# Altium schematic sheet CircuitControlDriver.SchDoc
size 420 x 297 mm; Address1: Address1; Address2: Address2; Address3: Address3; Address4: Address4; SheetNumber: 1; Scale: 1:1; Разраб.: Лепотенко А.С.; Обозначение документа: СЭЧП.425667.001 Э3; Наименование организации: Systems Electronic; Перв. применение: СЭЧП.425667.001 Э3; Наименование изделия 1: Блок управления ШДР; Наименование изделия 2: Схема электрическая; Наименование изделия 3: принципиальная; Нач. отд.: Нач. отд.
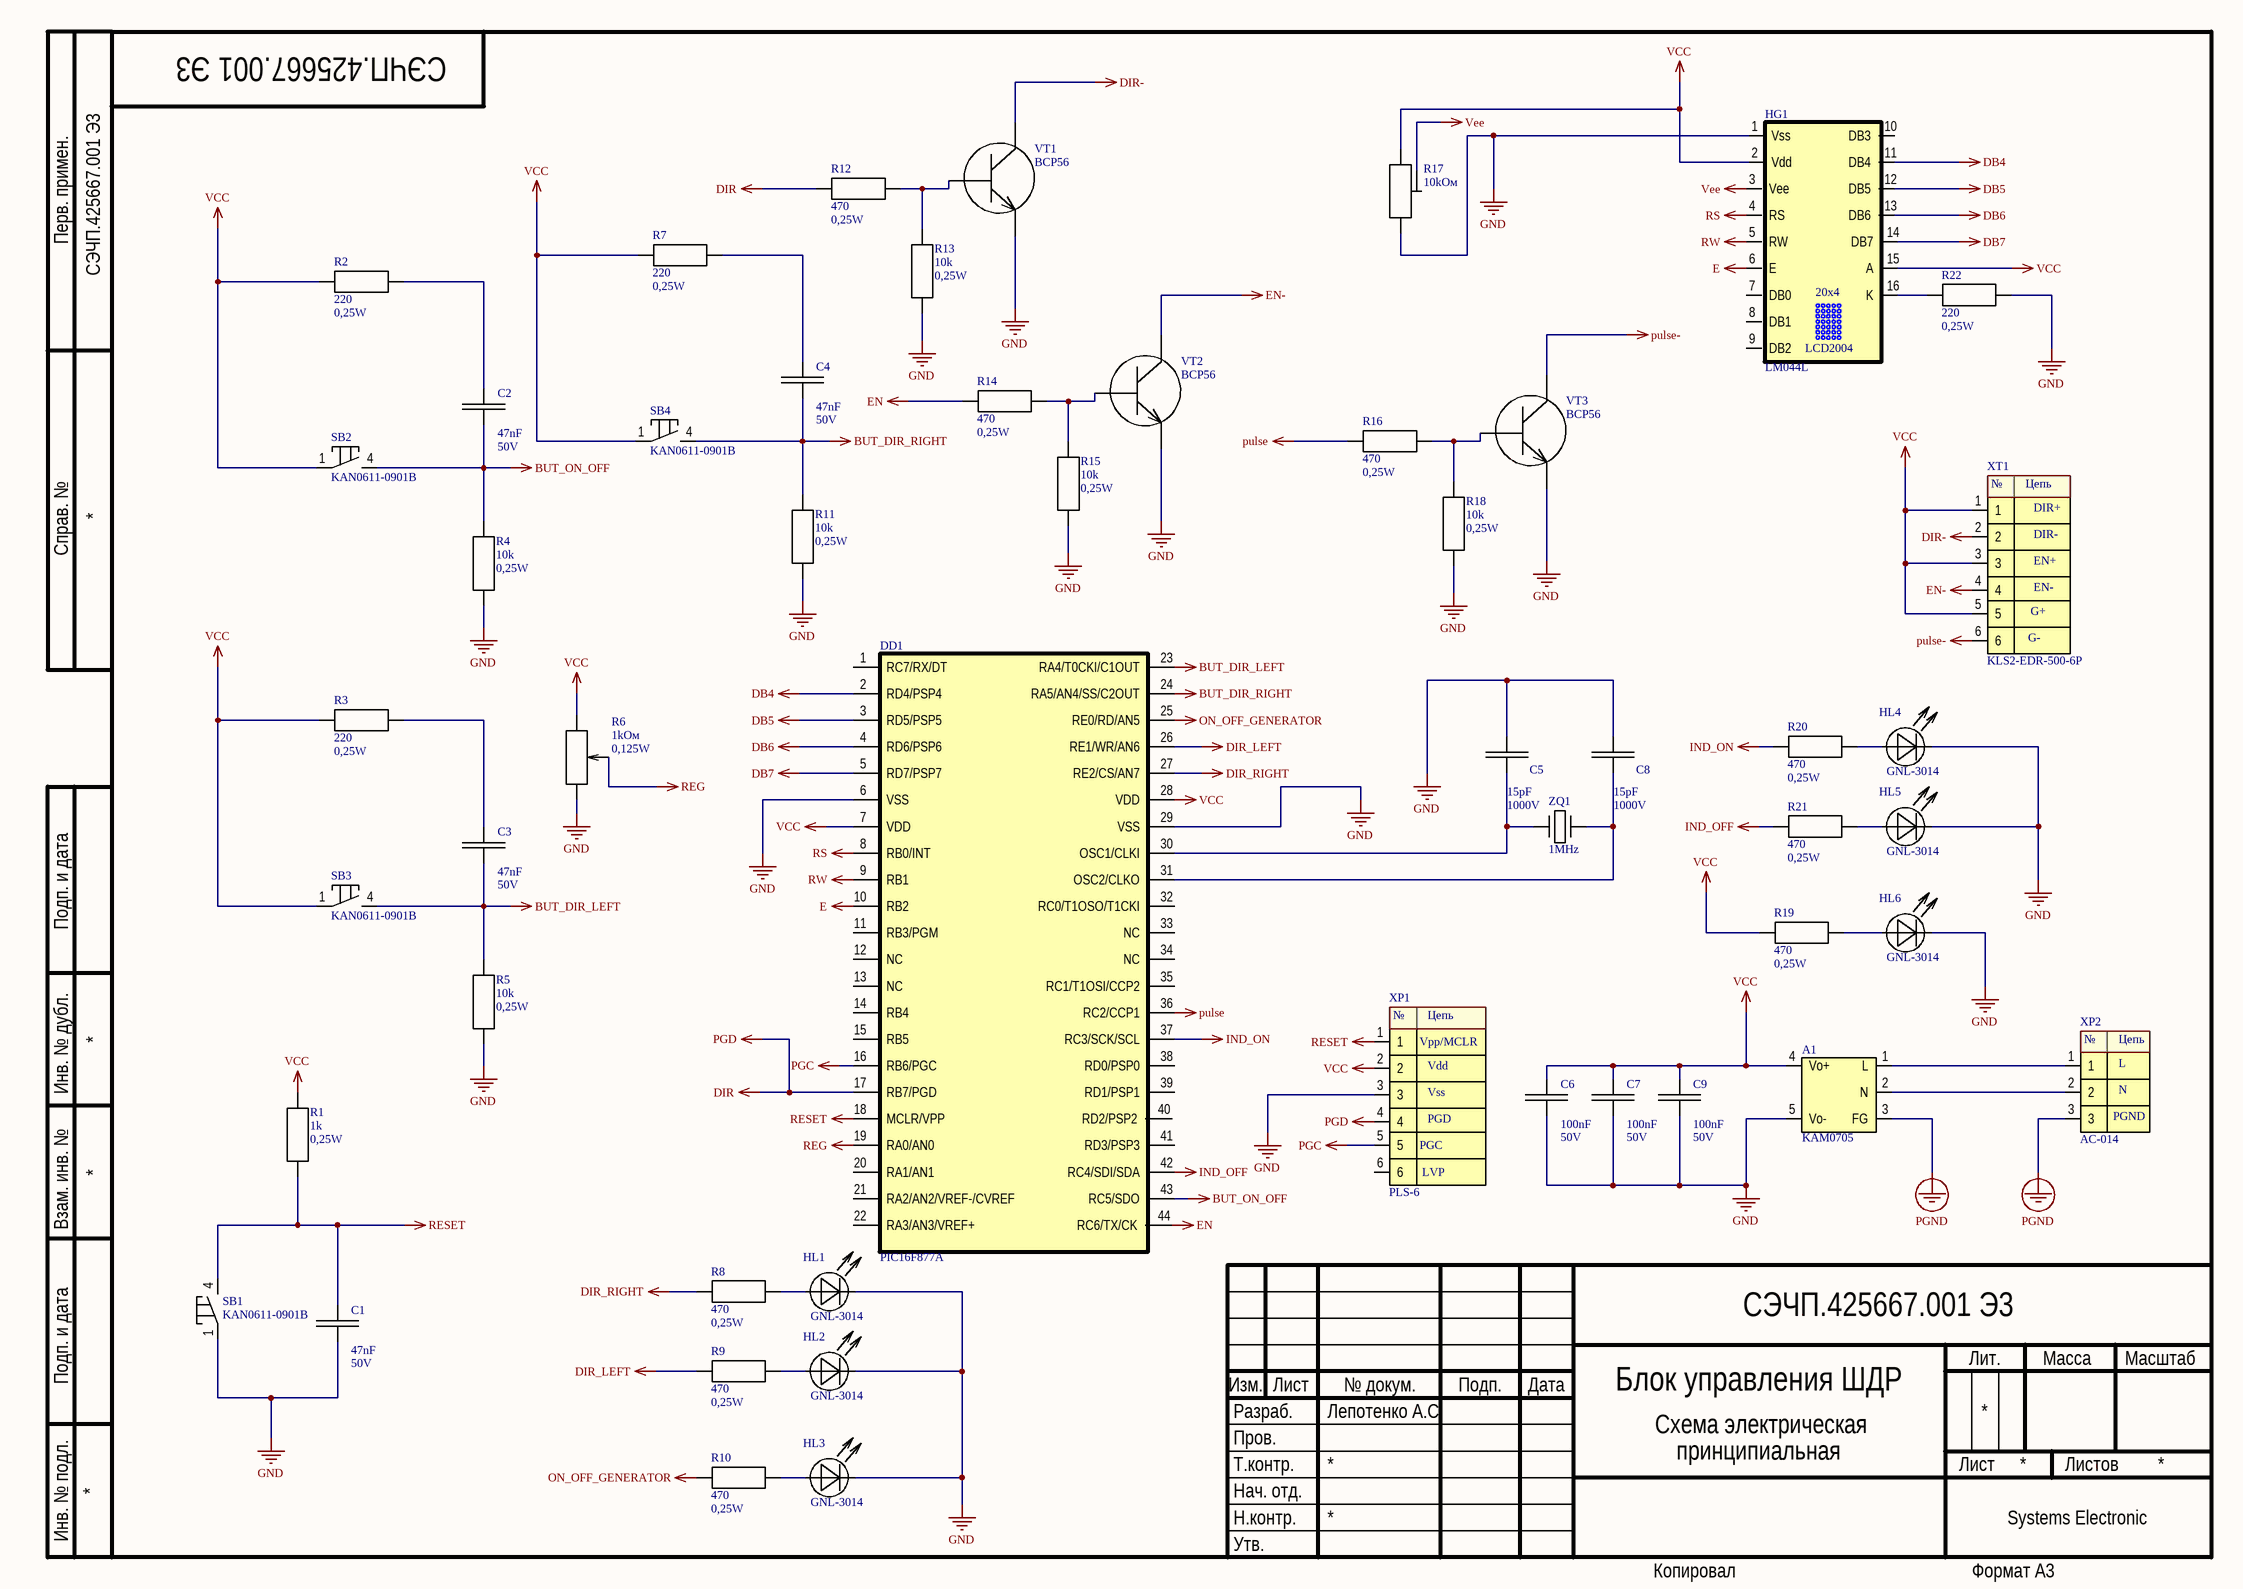
[diagram p0: CircuitControlDriver.SchDoc]

## Parts
A1  KAM0705  [KAM705]
C1  Voltage: 50V  [CAP1206]  (hidden comment: 47nF)
C2  Voltage: 50V  [CAP1206]  (hidden comment: 47nF)
C3  Voltage: 50V  [CAP1206]  (hidden comment: 47nF)
C4  Voltage: 50V  [CAP1206]  (hidden comment: 47nF)
C5  Voltage: 1000V  [CAP1206]  (hidden comment: 15pF)
C6  Voltage: 50V  [CAP1206]  (hidden comment: 100nF)
C7  Voltage: 50V  [CAP1206]  (hidden comment: 100nF)
C8  Voltage: 1000V  [CAP1206]  (hidden comment: 15pF)
C9  Voltage: 50V  [CAP1206]  (hidden comment: 100nF)
DD1  PIC16F877A  [TQFP80P1200X1200X120-44N]
HG1  LM044L  [LCD2004]
HL1  GNL-3014  [GNL-3014]
HL2  GNL-3014  [GNL-3014]
HL3  GNL-3014  [GNL-3014]
HL4  GNL-3014  [GNL-3014]
HL5  GNL-3014  [GNL-3014]
HL6  GNL-3014  [GNL-3014]
R1  value 1k  Power: 0,25W  [1206]  (hidden comment: 10k)
R2  Power: 0,25W  [1206]  (hidden comment: 220)
R3  Power: 0,25W  [1206]  (hidden comment: 220)
R4  Power: 0,25W  [1206]  (hidden comment: 10k)
R5  Power: 0,25W  [1206]  (hidden comment: 10k)
R6  1kОм  Power: 0,125W  [KC/C 16K1]
R7  Power: 0,25W  [1206]  (hidden comment: 220)
R8  Power: 0,25W  [1206]  (hidden comment: 470)
R9  Power: 0,25W  [1206]  (hidden comment: 470)
R10  Power: 0,25W  [1206]  (hidden comment: 470)
R11  Power: 0,25W  [1206]  (hidden comment: 10k)
R12  Power: 0,25W  [1206]  (hidden comment: 470)
R13  Power: 0,25W  [1206]  (hidden comment: 10k)
R14  Power: 0,25W  [1206]  (hidden comment: 470)
R15  Power: 0,25W  [1206]  (hidden comment: 10k)
R16  Power: 0,25W  [1206]  (hidden comment: 470)
R17  10kОм  [3006P]
R18  Power: 0,25W  [1206]  (hidden comment: 10k)
R19  Power: 0,25W  [1206]  (hidden comment: 470)
R20  Power: 0,25W  [1206]  (hidden comment: 470)
R21  Power: 0,25W  [1206]  (hidden comment: 470)
R22  Power: 0,25W  [1206]  (hidden comment: 220)
SB1  KAN0611-0901B  [KLS2]
SB2  KAN0611-0901B  [KLS2]
SB3  KAN0611-0901B  [KLS2]
SB4  KAN0611-0901B  [KLS2]
VT1  BCP56  [SOT223]
VT2  BCP56  [SOT223]
VT3  BCP56  [SOT223]
XP1  PLS-6  [DS1021-6]
XP2  AC-014  [Power AC-014]
XT1  KLS2-EDR-500-6P  [KLS2-EDR-500-6P]
ZQ1  1MHz  [HC-51U]

## Nets
BUT_DIR_LEFT: C3.2 DD1.23(RA4/T0CKI/C1OUT) R5.1 SB3.4
BUT_DIR_RIGHT: C4.2 DD1.24(RA5/AN4/SS/C2OUT) R11.1 SB4.4
BUT_ON_OFF: C2.2 DD1.43(RC5/SDO) R4.1 SB2.4
DB4: DD1.2(RD4/PSP4) HG1.11(DB4)
DB5: DD1.3(RD5/PSP5) HG1.12(DB5)
DB6: DD1.4(RD6/PSP6) HG1.13(DB6)
DB7: DD1.5(RD7/PSP7) HG1.14(DB7)
DIR: DD1.17(RB7/PGD) R12.1 XP1.4  [also labelled PGD]
DIR-: VT1.2 XT1.2
DIR_LEFT: DD1.26(RE1/WR/AN6) R9.1
DIR_RIGHT: DD1.27(RE2/CS/AN7) R8.1
E: DD1.10(RB2) HG1.6(E)
EN: DD1.44(RC6/TX/CK) R14.1
EN-: VT2.2 XT1.4
GND: A1.5(Vo-) C1.2 C5.1 C6.2 C7.2 C8.1 C9.2 DD1.6(VSS) DD1.29(VSS) HG1.1(Vss) HL1.2 HL2.2 HL3.2 HL4.2 HL5.2 HL6.2 R4.2 R5.2 R6.3 R11.2 R13.2 R15.2 R17.1 R18.2 R22.1 SB1.1 VT1.3 VT2.3 VT3.3 XP1.3
IND_OFF: DD1.42(RC4/SDI/SDA) R21.1
IND_ON: DD1.37(RC3/SCK/SCL) R20.1
ON_OFF_GENERATOR: DD1.25(RE0/RD/AN5) R10.1
PGC: DD1.16(RB6/PGC) XP1.5
PGND: A1.3(FG) XP2.3
pulse: DD1.36(RC2/CCP1) R16.1
pulse-: VT3.2 XT1.6
REG: DD1.19(RA0/AN0) R6.2
RESET: C1.1 DD1.18(MCLR/VPP) R1.2 SB1.4 XP1.1
RS: DD1.8(RB0/INT) HG1.4(RS)
RW: DD1.9(RB1) HG1.5(RW)
VCC: A1.4(Vo+) C6.1 C7.1 C9.1 DD1.7(VDD) DD1.28(VDD) HG1.2(Vdd) HG1.15(A) R1.1 R2.2 R3.2 R6.1 R7.2 R17.3 R19.1 SB2.1 SB3.1 SB4.1 XP1.2 XT1.1 XT1.3 XT1.5
Vee: HG1.3(Vee) R17.2
NetA1_1: A1.1(L) XP2.1
NetA1_2: A1.2(N) XP2.2
NetC2_1: C2.1 R2.1
NetC3_1: C3.1 R3.1
NetC4_1: C4.1 R7.1
NetC5_2: C5.2 DD1.30(OSC1/CLKI) ZQ1.1
NetC8_2: C8.2 DD1.31(OSC2/CLKO) ZQ1.2
NetHG1_16: HG1.16(K) R22.2
NetHL1_1: HL1.1 R8.2
NetHL2_1: HL2.1 R9.2
NetHL3_1: HL3.1 R10.2
NetHL4_1: HL4.1 R20.2
NetHL5_1: HL5.1 R21.2
NetHL6_1: HL6.1 R19.2
NetR12_2: R12.2 R13.1 VT1.1
NetR14_2: R14.2 R15.1 VT2.1
NetR16_2: R16.2 R18.1 VT3.1

Not connected (* = marked no-connect by the designer): DD1 1(RC7/RX/DT) 11(RB3/PGM) 12(NC) 13(NC) 14(RB4) 15(RB5) 20(RA1/AN1) 21(RA2/AN2/VREF-/CVREF) 22(RA3/AN3/VREF+) 32(RC0/T1OSO/T1CKI) 33(NC) 34(NC) 35(RC1/T1OSI/CCP2) 38(RD0/PSP0) 39(RD1/PSP1) 40(RD2/PSP2) 41(RD3/PSP3); HG1 7(DB0) 8(DB1) 9(DB2) 10(DB3); XP1 6

## Notes on the sheet
- Перв. примен.
- Справ. №
- Подп. и дата
- Инв. № дубл.
- Взам. инв. №
- Разраб.
- Изм.
- Лист
- № докум.
- Подп.
- Дата
- Лит.
- Масса
- Масштаб
- Пров.
- Т.контр.
- Листов
- Инв. № подл.
- Утв.
- Н.контр.
- Копировал
- Формат А3
- (in symbol KLS2-EDR-500-6P) №; Цепь; DIR+; DIR-; EN+; EN-; G+; G-
- (in symbol LM044L) 20x4; LCD2004
- (in symbol PLS-6-1) №; Цепь; Vpp/MCLR; Vdd; Vss; PGD; PGC; LVP
- (in symbol Power Connector AC-014) №; Цепь; L; N; PGND

## Library data of the parts
A1 = KAM0705: Manufacturer: CHINFA ELECTRONICS; Value: 220V/5V; Part Number: KAM0705; Quantity: 1; Package: 48x45x18.5; Price: 23; ShoppingPlace: https://www.ru-chipdip.by/product/kam-0705
C1-C4 = Capasitor: Part Number: 120647nY5V-50V; Manufacturer: FAITHFULL LINK; Value: 47nF; Quantity: 4; Package: 1206; Price: 0,025; ShoppingPlace: http://belchip.by/product/?selected_product=03137
C5 C8 = Capasitor: Part Number: 1206150NPO; Manufacturer: NPO; Value: 15pF; Quantity: 2; Package: 1206; Price: 0,035; ShoppingPlace: http://belchip.by/product/?selected_product=00257
C6 C7 C9 = Capasitor: Part Number: CL31B104KBCNNNC; Manufacturer: Samsung; Value: 100nF; Quantity: 3; Package: 1206; Price: 0,015; ShoppingPlace: http://belchip.by/product/?selected_product=03137
DD1 = PIC16F877A: Manufacturer: Micchip; Part Number: PIC16F877A; Price: 2.76; ShoppingPlace: https://ru.aliexpress.com/item/Free-Shipping-5pcs-lot-PIC16F877A-PIC16F877A-I-PT-Microcontrollers-SMD-TQFP-44-new-original/32589109618.html?s=p&ws_ab_test=searchweb0_0,searchweb201602_2_10152_10151_10065_10344_10068_5722815_10342_10343_10340_5722915_10341_5722615_10697_10696_10084_10083_10618_10307_5722715_10059_10534_308_100031_10103_441_10624_10623_10622_5722515_10621_10620,searchweb201603_1,ppcSwitch_5&algo_expid=19ea4dca-365d-404e-8202-e740e16aa93f-5&algo_pvid=19ea4dca-365d-404e-8202-e740e16aa93f&transAbTest=ae803_2&priceBeautifyAB=0; Package: TQFP-44; Quantity: 1
HG1 = LM044L: Part Number: LM044L-HD44780U; Manufacturer: HITACHI; Package: 16x2.54; ShoppingPlace: https://ru.aliexpress.com/item/LCD-Module-Display-2004-204-HD44780-Yellow-Green-Blacklight-FOR-ARDUINO/32627610997.html?ws_ab_test=searchweb0_0,searchweb201602_2_10152_10151_10065_10344_10068_5722815_10342_10343_10340_5722915_10341_5722615_10697_10696_10084_10083_10618_10307_5722715_10059_10534_308_100031_10103_441_10624_10623_10622_5722515_10621_10620,searchweb201603_1,ppcSwitch_5&algo_expid=81ba670d-1ac6-4fbd-8476-00369042280d-42&algo_pvid=81ba670d-1ac6-4fbd-8476-00369042280d&transAbTest=ae803_2&priceBeautifyAB=0; Quantity: 1; Price: 6.36
HL1-HL6 = LED: Part Number: GNL-3014SRD; Manufacturer: G-NOR; Value: RED; Price: 0.04; Package: GNL; Quantity: 6; ShoppingPlace: http://belchip.by/product/?selected_product=00813
R1 = Resistor: Manufacturer: Royal Ohm; Part Number: RC1206FR-071KL; Quntity: 4; Price: 0,02; Package: 1206; ShoppingPlace: http://belchip.by/product/?selected_product=19295
R2 R3 R7 R22 = Resistor: Manufacturer: YAGEO; Part Number: RC1206JR-07220L; Quntity: 4; Price: 0,15; Package: 1206; ShoppingPlace: http://belchip.by/product/?selected_product=01368; Value: 220
R4 R5 R11 R13 R15 R18 = Resistor: Manufacturer: YAGEO; Part Number: RC1206JR-0710KL; Quntity: 4; Price: 0,15; Package: 1206; ShoppingPlace: http://belchip.by/product/?selected_product=31101; Value: 10k
R6 = POT-HG: Part Number: 16K1; Manufacturer: RUICHI; Value: 1000; Price: 0,6; ShoppingPlace: http://belchip.by/product/?selected_product=04561; Quantity: 1; Package: 5x5
R8-R10 R12 R14 R16 R19-R21 = Resistor: Manufacturer: YAGEO; Part Number: RC1206JR-07470RL; Quntity: 5; Price: 0,15; Package: 1206; ShoppingPlace: http://belchip.by/product/?selected_product=32449; Value: 470
R17 = POT: Part Number: 3006-103-Z-LF; Manufacturer: Bours; Power: 0,125W; Package: 3006; Price: 0,445; ShoppingPlace: http://belchip.by/product/?selected_product=32831; Value: 10kОм; Quantity: 1
SB1-SB4 = Button: Manufacturer: RUICHI; Value: 100V; Part Number: KAN0611-0901B; Price: 0,05; ShoppingPlace: http://belchip.by/product/?selected_product=14924; Quantity: 4; Package: T112
VT1-VT3 = BCP56-16: Manufacturer: NXP Semiconductors; Part Number: BCP56-16; Price: BCP56; ShoppingPlace: http://belchip.by/product/?selected_product=12583; Quantity: 2; Package: SOT223
XP1 = PLS-6-1: Part Number: PLS-40; Manufacturer: RUICHI; Value: 100V; Quantity: 1; Price: 0,12; ShoppingPlace: http://belchip.by/product/?selected_product=02009; Package: DS2021-6
XP2 = Power Connector AC-014: Manufacturer: RUICHI; Value: 220V; Part Number: AC-014; Quantity: 1; Price: 1.62; ShoppingPlace: http://belchip.by/product/?selected_product=31383; Package: AC-015-8mm-step
XT1 = KLS2-EDR-500-6P: Manufacturer: KLS; Value: 15A300V; Part Number: KLS2-EDR-500-6P; Package: KLS2-6; Price: 0,13; ShoppingPlace: http://belchip.by/product/?selected_product=03190; Quantity: 1
ZQ1 = Rzanator: Part Number: HC-51; Manufacturer: CHina; Value: 1MHz; Package: HC-51; Quantity: 1; Price: 13; ShoppingPlace: https://ru.aliexpress.com/item/1-MHz-Quartz-Crystal-Resonator-HC-51-U-1-000-MHz-1000-KHz/32542776281.html?ws_ab_test=searchweb0_0,searchweb201602_2_10152_10151_10065_10344_10068_10342_10343_10340_10341_10697_10696_10084_5722520_10083_10618_10307_10059_5722620_5722920_10534_308_5722720_5722820_100031_10103_441_10624_10623_10622_10621_10620,searchweb201603_68,ppcSwitch_5&algo_expid=89d4295e-121a-47e9-b7f5-26405723b7a9-0&algo_pvid=89d4295e-121a-47e9-b7f5-26405723b7a9&transAbTest=ae803_2&priceBeautifyAB=0